# EAGLE design Motion_2 (EAGLE 9.5.2)
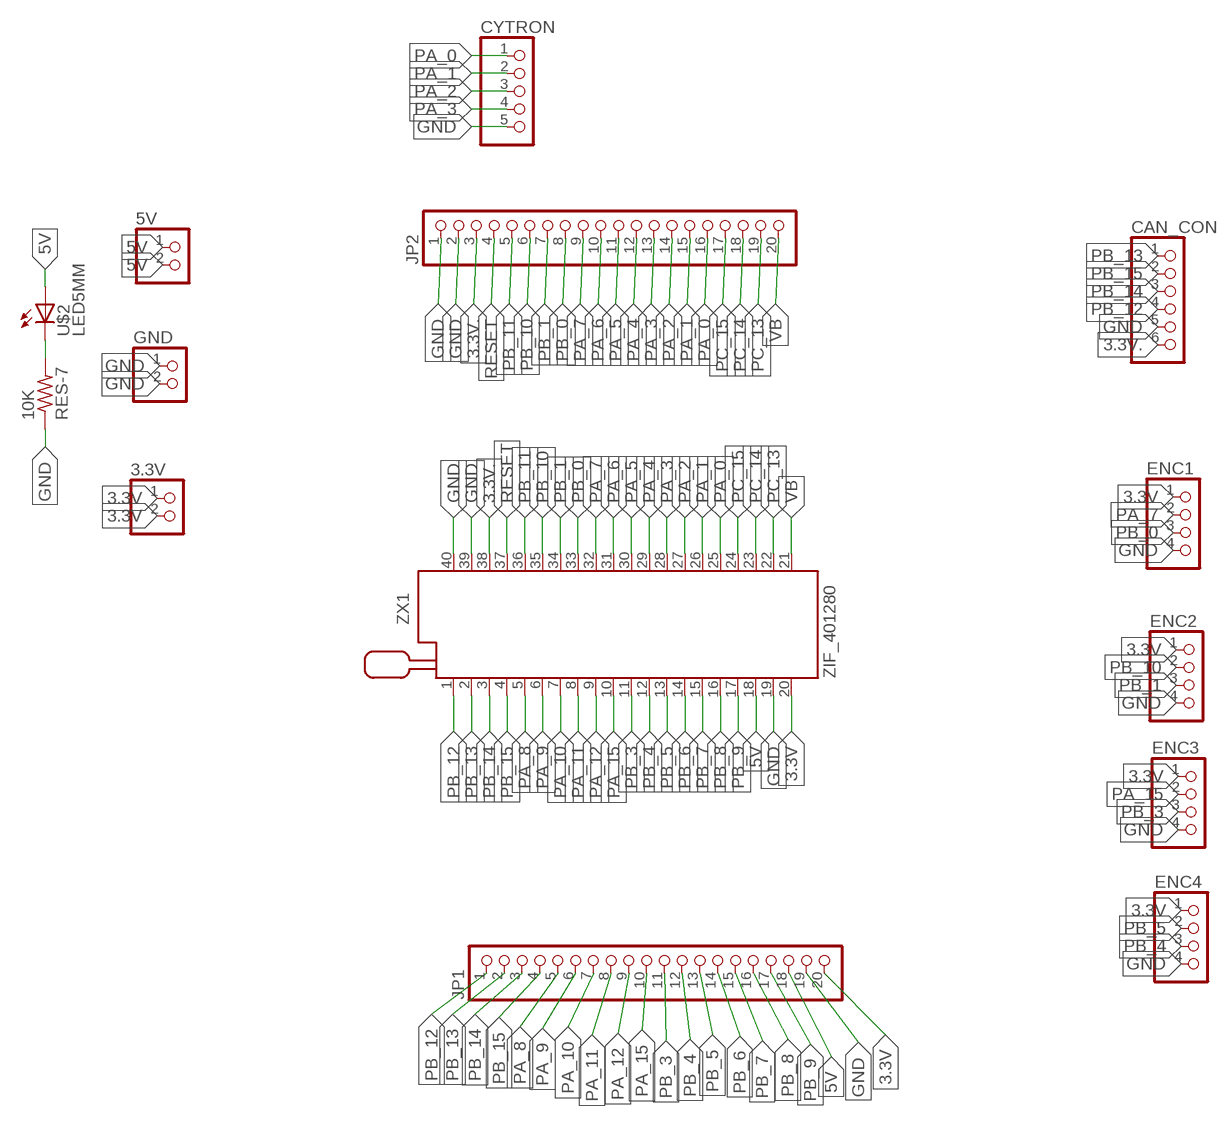
[diagram p0: schematic, sheet 1]

## Parts
3.3V  PINHD-2_DATA  [1X02_DATA]
5V  PINHD-2_DATA  [1X02_DATA]
10K  RES-7  [0204/7]
CAN_CON  PINHD-6_DATA  [1X06_DATA]
CYTRON  PINHD-5_DATA  [1X05_DATA]
ENC1  PINHD-4_DATA  [1X04_DATA]
ENC2  PINHD-4_DATA  [1X04_DATA]
ENC3  PINHD-4_DATA  [1X04_DATA]
ENC4  PINHD-4_DATA  [1X04_DATA]
GND  PINHD-2_DATA  [1X02_DATA]
JP1  PINHD-1X20  [1X20]
JP2  PINHD-1X20  [1X20]
U$2  LED5MM  [LED5MM]
ZX1  ZIF_401280  [240-1280-00-0602J]

## Nets
3.3V: 3.3V.1 3.3V.2 ENC1.1 ENC2.1 ENC3.1 ENC4.1 JP1.20 ZX1.20
3.3V.: CAN_CON.6 JP2.3 ZX1.38
5V: 5V.1 5V.2 JP1.18 U$2.A ZX1.18
GND: 10K.1 CAN_CON.5 CYTRON.5 ENC1.4 ENC2.4 ENC3.4 ENC4.4 GND.1 GND.2 JP1.19 JP2.1 JP2.2 ZX1.19 ZX1.39 ZX1.40
N$1: 10K.2 U$2.K(C)
PA_0: CYTRON.1 JP2.16 ZX1.25
PA_1: CYTRON.2 JP2.15 ZX1.26
PA_2: CYTRON.3 JP2.14 ZX1.27
PA_3: CYTRON.4 JP2.13 ZX1.28
PA_4: JP2.12 ZX1.29
PA_5: JP2.11 ZX1.30
PA_6: JP2.10 ZX1.31
PA_7: ENC1.2 JP2.9 ZX1.32
PA_8: JP1.5 ZX1.5
PA_9: JP1.6 ZX1.6
PA_10: JP1.7 ZX1.7
PA_11: JP1.8 ZX1.8
PA_12: JP1.9 ZX1.9
PA_15: ENC3.2 JP1.10 ZX1.10
PB_0: ENC1.3 JP2.8 ZX1.33
PB_1: ENC2.3 JP2.7 ZX1.34
PB_3: ENC3.3 JP1.11 ZX1.11
PB_4: ENC4.3 JP1.12 ZX1.12
PB_5: ENC4.2 JP1.13 ZX1.13
PB_6: JP1.14 ZX1.14
PB_7: JP1.15 ZX1.15
PB_8: JP1.16 ZX1.16
PB_9: JP1.17 ZX1.17
PB_10: ENC2.2 JP2.6 ZX1.35
PB_11: JP2.5 ZX1.36
PB_12: CAN_CON.4 JP1.1 ZX1.1
PB_13: CAN_CON.1 JP1.2 ZX1.2
PB_14: CAN_CON.3 JP1.3 ZX1.3
PB_15: CAN_CON.2 JP1.4 ZX1.4
PC_13: JP2.19 ZX1.22
PC_14: JP2.18 ZX1.23
PC_15: JP2.17 ZX1.24
RESET: JP2.4 ZX1.37
VB: JP2.20 ZX1.21

## Library data of the parts
3.3V 5V GND = MIA_LIBRARY-2-2-2:PINHD-2_DATA: PIN HEADER
10K = MIA_LIBRARY-2-2-2:RES-7
CAN_CON = MIA_LIBRARY-2-2-2:PINHD-6_DATA: PIN HEADER
CYTRON = MIA_LIBRARY-2-2-2:PINHD-5_DATA: PIN HEADER
ENC1-ENC4 = MIA_LIBRARY-2-2-2:PINHD-4_DATA: PIN HEADER
JP1 JP2 = MIA_LIBRARY-2-2-2:PINHD-1X20: PIN HEADER
U$2 = MIA_LIBRARY-2-2-2:LED5MM
ZX1 = MIA_LIBRARY-2-2-2:ZIF_40: Zero Insertion Force Socked Source: http://www.3M.com/ehpd

## Board
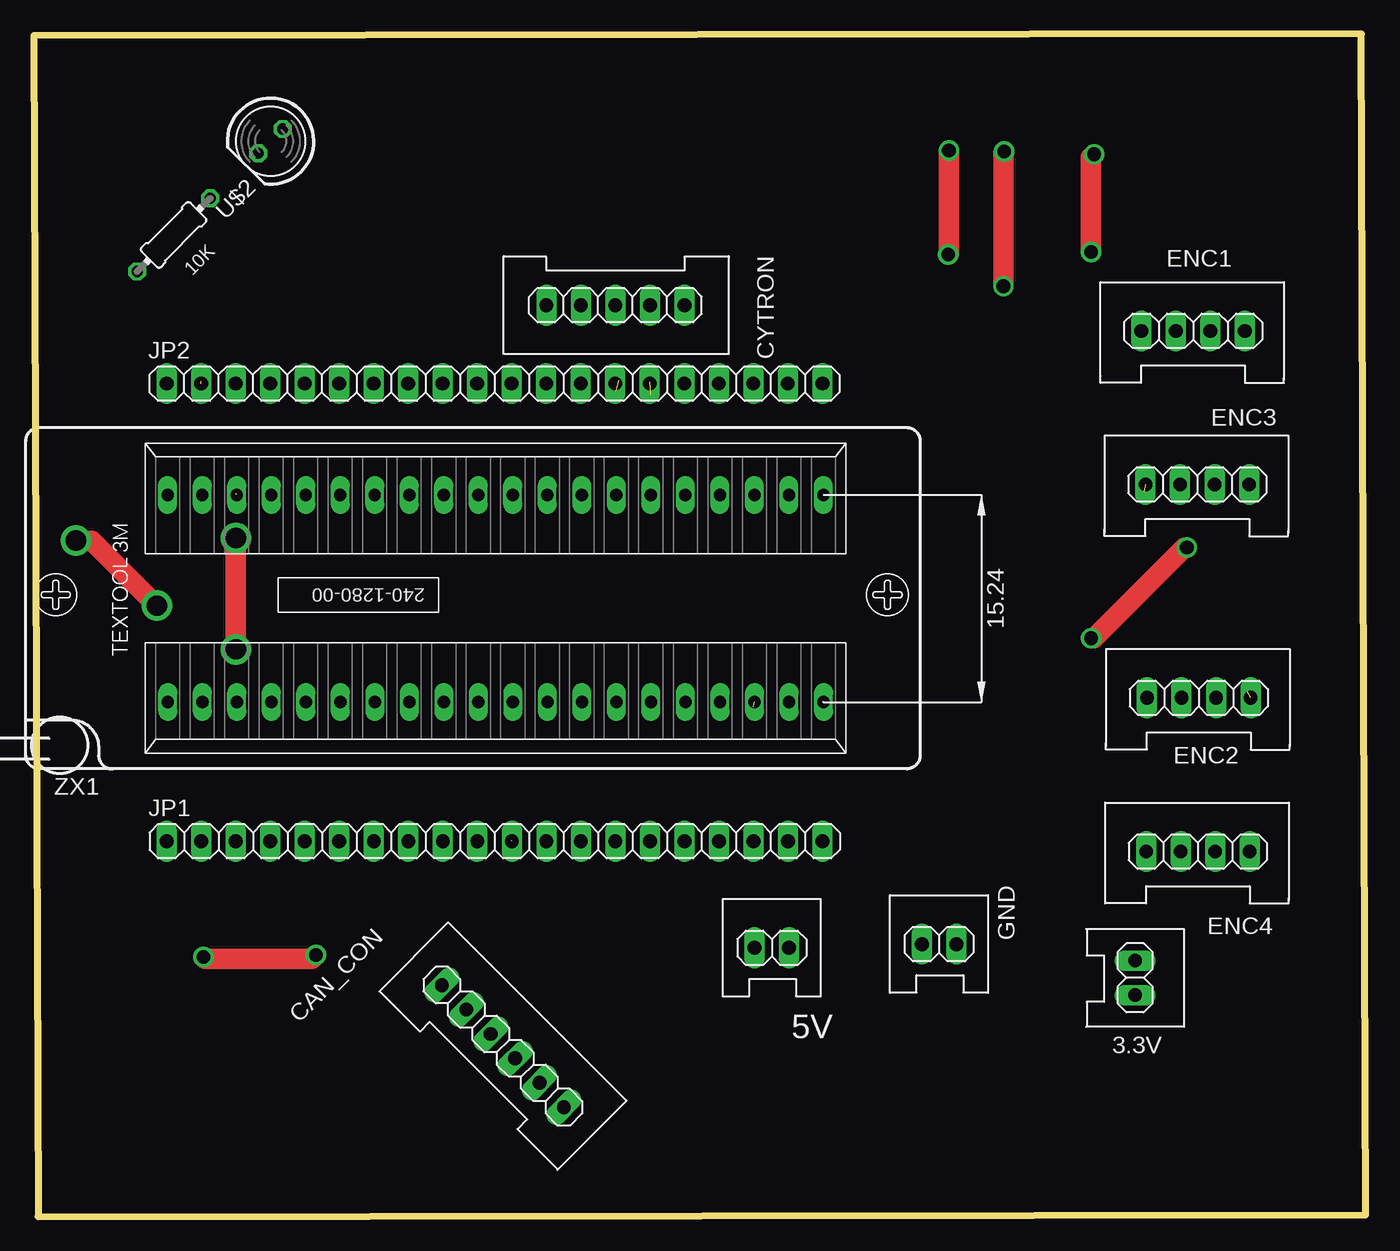
[diagram p1: board, top side]
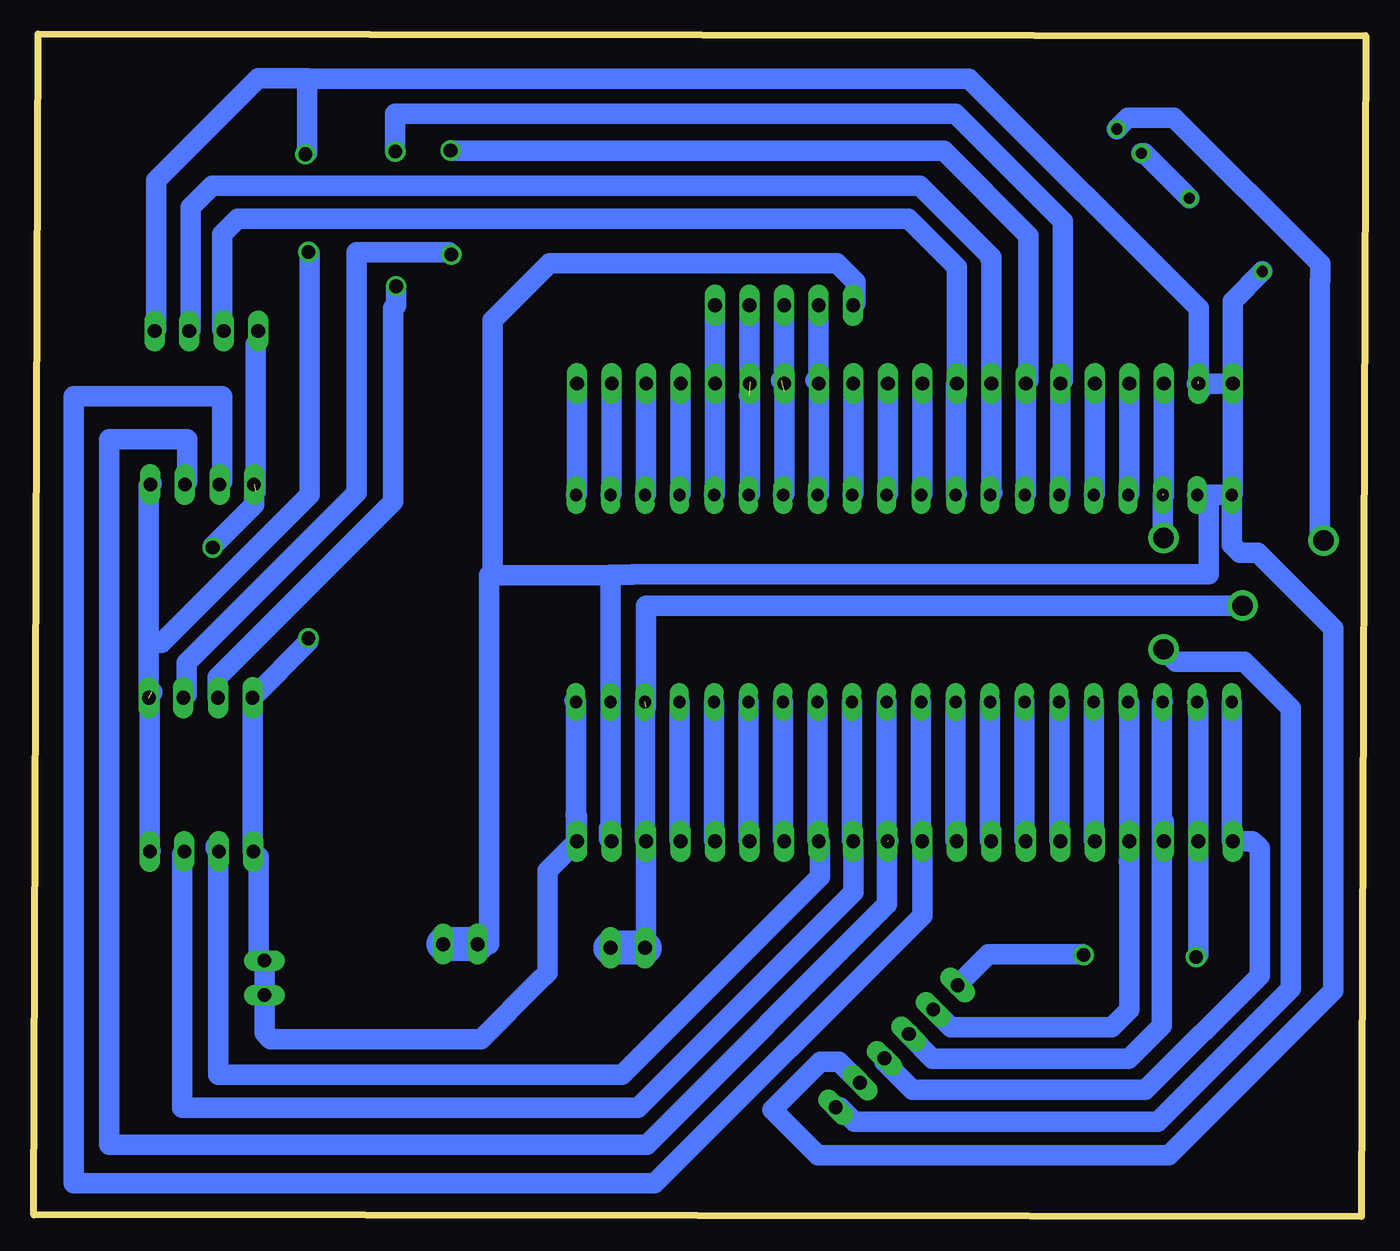
[diagram p2: board, bottom side, seen from below]

Size 98 x 87.01 mm. Coordinates in mm from the lower left corner, seen from the top.
Outline: 0.31,0 98,0.13 97.69,87.01 0,86.88 0.31,0
Copper layers (1*16): Top 0.035mm / dielectric 1.5mm / Bottom 0.035mm
Design rules "default *": minimum track width 6mil, minimum drill 0.35mm, track to track 0.8mm, track to pad 0.8mm, pad to pad 0.8mm, via to via 0.8mm, smd to smd 6mil, copper to edge 40mil, drill to drill 6mil, minimum pad ring 10mil, minimum via ring 8mil, stop-mask expansion 4mil, vias tented up to drill 0mil, thermal gap 10mil

### Footprints (pad centres in the part's own frame; a part is rotated, then mirrored left to right if it is on the bottom)
1X02_DATA = drill 1.016 long: 1 -1.27,0; 2 1.27,0
0204/7 = drill 0.813 octagon: 1 -3.81,0; 2 3.81,0
1X06_DATA = drill 1.016 long: 1 -6.35,0; 2 -3.81,0; 3 -1.27,0; 4 1.27,0; 5 3.81,0; 6 6.35,0
1X05_DATA = drill 1.016 long: 1 -5.08,0; 2 -2.54,0; 3 0,0; 4 2.54,0; 5 5.08,0
1X04_DATA = drill 1.016 long: 1 -3.81,0; 2 -1.27,0; 3 1.27,0; 4 3.81,0
1X20 = drill 1.016 long: 1 -24.13,0; 2 -21.59,0; 3 -19.05,0; 4 -16.51,0; 5 -13.97,0; 6 -11.43,0; 7 -8.89,0; 8 -6.35,0; 9 -3.81,0; 10 -1.27,0; 11 1.27,0; 12 3.81,0; 13 6.35,0; 14 8.89,0; 15 11.43,0; 16 13.97,0; 17 16.51,0; 18 19.05,0; 19 21.59,0; 20 24.13,0
LED5MM = drill 0.813 octagon: A -1.27,0; K 1.27,0
240-1280-00-0602J = drill 0.9 long: 1 -24.12,-8.88; 2 -21.58,-8.88; 3 -19.04,-8.88; 4 -16.5,-8.88; 5 -13.96,-8.88; 6 -11.42,-8.88; 7 -8.88,-8.88; 8 -6.34,-8.88; 9 -3.8,-8.88; 10 -1.26,-8.88; 11 1.28,-8.88; 12 3.82,-8.88; 13 6.36,-8.88; 14 8.9,-8.88; 15 11.44,-8.88; 16 13.98,-8.88; 17 16.52,-8.88; 18 19.06,-8.88; 19 21.6,-8.88; 20 24.14,-8.88; 21 24.13,6.35; 22 21.59,6.35; 23 19.05,6.35; 24 16.51,6.35; 25 13.97,6.35; 26 11.43,6.35; 27 8.89,6.35; 28 6.35,6.35; 29 3.81,6.35; 30 1.27,6.35; 31 -1.27,6.35; 32 -3.81,6.35; 33 -6.35,6.35; 34 -8.89,6.35; 35 -11.43,6.35; 36 -13.97,6.35; 37 -16.51,6.35; 38 -19.05,6.35; 39 -21.59,6.35; 40 -24.13,6.35

### Placement (x,y rotation side)
3.3V  81.04,17.57 270 top
5V  54.3,19.78 0 top
10K  10.28,72.23 45 top
CAN_CON  34.51,12.54 315 top
CYTRON  42.79,67.06 180 top
ENC1  85.31,65.16 0 top
ENC2  85.73,38.17 0 top
ENC3  85.62,53.87 0 top
ENC4  85.66,26.86 0 top
GND  66.61,20.05 0 top
JP1  33.9,27.62 0 top
JP2  33.89,61.29 0 top
U$2  17.41,79.12 225 top
ZX1  33.97,46.75 0 top

### Tracks (layer width: path | path; a pad name or v marks a point on that pad's centre or on a via)
3.3V  (via drill 1)  (1 unrouted)
  Top 1.5: v77.81,42.55 77.99,42.55 84.66,49.22 v84.85,49.22
  Bottom 1.5: JP1.20 58.03,27.27 | ENC1.1 81.5,64.4 81.7,64.2 81.7,53.34 | 81.8,38.29 ENC2.1 | ENC2.1 81.92,26.93 ENC4.1 | JP1.20 58.03,29.44 58.15,29.56 | 81.75,26.76 ENC4.1 | ENC4.1 81.45,26.46 81.45,19.26 80.88,18.69 80.89,18.69 3.3V.1 3.3V.2 81.04,13.52 80.58,13.06 65.09,13.06 60.92,17.23 60.21,17.94 60.21,25.44 JP1.20 | ENC2.1 77.81,42.28 v77.81,42.55 | v84.85,49.22 84.85,49.34 81.81,52.38 ENC3.1 | JP1.20 58.11,27.7 ZX1.20 58.2,37.96
3.3V.  (via drill 1.5)  (1 unrouted)
  Top 1.5: v14.86,49.92 v14.86,41.74
  Bottom 1.5: 14.84,53.02 ZX1.38 14.92,49.98 v14.86,49.92 | JP2.3 14.84,53.18 | CAN_CON.6 38.68,8.05 37.62,7 15.27,7 5.5,16.77 5.5,37.41 8.92,40.83 13.95,40.83 v14.86,41.74
5V  (via drill 1.5)  (1 unrouted)
  Top 1.5: v3.1,49.74 4.27,49.74 v9.05,44.96 v9.05,44.95
  Bottom 1.5: JP1.18 53.04,27.71 53.04,29.1 | v9.05,44.95 52.97,44.95 52.97,37.51 | v3.1,49.74 3.36,49.48 3.37,49.48 3.37,68.84 3.34,68.87 3.34,70.11 14.09,80.86 17.48,80.86 18.26,80.09 18.26,80.07 U$2.A | ZX1.18 53.03,27.7 JP1.18 | JP1.18 52.95,19.86 5V.1
  Bottom 2.5: 5V.1 5V.2
GND  (via drill 1)  (2 unrouted)
  Top 1.5: v77.8,70.98 77.8,77.95 v78.01,78.16
  Bottom 1: GND.1 65.34,20 65.22,19.88
  Bottom 1.5: 12.09,61.25 12.09,60.89 12.26,61.06 12.26,66.81 29.18,83.73 77.9,83.73 | 12.09,61.25 12.09,61.43 12.33,61.19 12.43,61.29 JP2.1 | 89.34,53.96 ENC3.4 89.54,53.76 89.54,42.22 | 89.42,26.91 ENC4.4 89.47,38.39 89.31,38.55 89.31,38.6 | 55.69,28.58 55.69,27.82 JP1.19 55.57,27.7 ZX1.19 55.57,47.2 | ENC2.4 89.54,42.22 | 12.09,61.25 12.3,61.46 | ENC1.4 89.01,65.27 89.01,76.23 81.5,83.75 77.9,83.75 77.9,83.73 | GND.1 65.19,20.2 65.16,20.2 | v77.8,70.98 77.7,70.88 77.7,53.1 88.58,42.22 89.54,42.22 | v78.01,78.16 77.9,78.27 77.9,83.73 | 68.17,19.76 GND.2 64.49,20.05 64.49,47.2 64.26,47.2 | CAN_CON.5 37.22,9.85 38.75,11.38 40.13,11.38 43.64,7.87 40.29,4.52 14.49,4.52 2.39,16.62 2.39,43.28 7.93,48.83 9.25,48.83 9.84,49.42 ZX1.40 | JP2.1 9.76,67.36 10K.1 | CYTRON.5 37.56,67.21 37.56,68.78 38.91,70.13 60.07,70.13 64.26,65.94 64.26,47.2 | JP2.1 9.76,53.18 ZX1.40 | ZX1.40 11.54,53.1 11.54,47.25 53.92,47.25 53.96,47.21 55.57,47.21 55.57,47.2 | 11.71,53.1 ZX1.39 | 55.57,47.2 64.26,47.2
  Bottom 2.5: GND.1 GND.2
N$1
  Bottom 1.5: 10K.2 16.27,78.22 U$2.K
PA_0
  Bottom 1.5: CYTRON.1 47.88,60.77 47.86,60.75 JP2.16 47.86,53.18 ZX1.25
PA_1  (1 unrouted)
  Bottom 1.5: 45.34,61.43 45.32,61.41 JP2.15 45.32,53.18 ZX1.26 | CYTRON.2 45.33,60.48 45.38,60.43
PA_2  (1 unrouted)
  Bottom 1.5: 42.79,60.72 CYTRON.3 | 43.01,61.52 JP2.14 42.78,53.18 ZX1.27
PA_3
  Bottom 1.5: 40.24,61.74 JP2.13 | JP2.13 40.47,61.52 | JP2.13 CYTRON.4 | JP2.13 40.24,53.18 ZX1.28
PA_4
  Bottom 1.5: JP2.12 37.7,53.18 ZX1.29
PA_5
  Bottom 1.5: JP2.11 35.16,53.18 ZX1.30
PA_6
  Bottom 1.5: JP2.10 32.62,53.18 ZX1.31
PA_7
  Bottom 1.5: 84.02,65.18 ENC1.2 84.16,65.28 84.16,72.26 83,73.42 33.66,73.42 30.08,69.84 JP2.9 30.16,61.21 ZX1.32 30.08,53.18
PA_8
  Bottom 1.5: ZX1.5 20.01,27.7 JP1.5
PA_9
  Bottom 1.5: ZX1.6 22.55,27.7 JP1.6
PA_10
  Bottom 1.5: ZX1.7 25.09,27.7 JP1.7
PA_11
  Bottom 1.5: ZX1.8 27.63,27.7 JP1.8
PA_12
  Bottom 1.5: ZX1.9 30.17,27.7 JP1.9
PA_15
  Bottom 1.5: ENC3.2 84.14,54.08 84.14,60.37 95.07,60.37 95.07,2.46 52.32,2.46 32.63,22.14 JP1.10 32.71,27.7 ZX1.10
PB_0
  Bottom 1.5: 86.56,65.18 ENC1.3 86.47,65.27 86.47,74.25 84.88,75.84 32.81,75.84 27.54,70.57 27.54,70.46 | 27.63,70.55 27.54,70.46 | 27.45,53.27 ZX1.33 27.56,53.1 27.54,53.12 JP2.8 27.54,70.46
PB_1  (via drill 1)
  Top 1.5: v67.34,78.43 67.34,70.84 v67.29,70.79
  Bottom 1.5: ENC2.3 86.77,38.4 86.77,40.75 74.25,53.27 74.25,70.94 67.44,70.94 v67.29,70.79 | v67.34,78.43 67.32,78.41 31.04,78.41 24.81,72.17 24.81,61.48 JP2.7 25,53.18 ZX1.34
PB_3  (1 unrouted)
  Bottom 1.5: ENC3.3 86.71,54.05 86.71,57.19 92.45,57.19 92.45,5.31 52.9,5.31 35.21,23 35.21,27.58 JP1.11 | ZX1.11 35.25,27.79 35.12,27.66
PB_4
  Bottom 1.5: ENC4.3 87.11,26.68 87.11,8.02 53.55,8.02 37.69,23.88 37.69,27.6 JP1.12 37.79,27.7 ZX1.12
PB_5
  Bottom 1.5: 84.62,27.26 84.62,27.09 ENC4.2 84.39,27.2 84.45,27.26 84.45,10.44 54.72,10.44 40.16,25 40.16,27.53 JP1.13 40.33,27.7 ZX1.13
PB_6
  Bottom 1.5: ZX1.14 42.87,27.7 JP1.14
PB_7
  Bottom 1.5: ZX1.15 45.41,27.7 JP1.15
PB_8
  Bottom 1.5: ZX1.16 47.95,27.7 JP1.16
PB_9
  Bottom 1.5: ZX1.17 50.49,27.7 JP1.17
PB_10  (via drill 1)
  Top 1.5: v71.41,78.35 71.34,78.28 71.34,69.03 71.35,69.02 v71.35,68.45
  Bottom 1.5: ENC2.2 84.47,39.67 71.55,52.59 71.55,66.82 71.35,67.02 v71.35,68.45 | v71.41,78.35 71.41,81.15 30.2,81.15 22.27,73.22 22.27,61.48 JP2.6 22.46,53.18 ZX1.35
PB_11
  Bottom 1.5: JP2.5 19.92,53.18 ZX1.36
PB_12
  Bottom 1.5: CAN_CON.4 35.41,11.4 33.34,9.33 16.19,9.33 7.8,17.72 7.8,27.1 8.32,27.62 JP1.1 9.85,27.7 ZX1.1
PB_13  (via drill 1)
  Top 1.5: v20.76,19.26 20.47,18.97 12.6,18.97 v12.47,19.1
  Bottom 1.5: v12.47,19.1 12.31,19.26 JP1.2 12.31,37.79 ZX1.2 | v20.76,19.26 20.81,19.31 27.74,19.31 CAN_CON.1
PB_14
  Bottom 1.5: 15,29.2 14.85,29.05 JP1.3 | 15,29.2 15,14.04 17.41,11.63 31.87,11.63 33.61,13.37 CAN_CON.3 | ZX1.3 15,37.8 15,29.2
PB_15
  Bottom 1.5: 17.42,26.12 17.39,26.15 JP1.4 | CAN_CON.2 30.51,13.93 18.68,13.93 17.39,15.22 JP1.4 | ZX1.4 17.39,37.79 JP1.4
PC_13
  Bottom 1.5: JP2.19 55.48,53.18 ZX1.22
PC_14
  Bottom 1.5: JP2.18 52.94,53.18 ZX1.23
PC_15
  Bottom 1.5: JP2.17 50.4,53.18 ZX1.24
RESET
  Bottom 1.5: JP2.4 17.38,53.18 ZX1.37
VB
  Bottom 1.5: JP2.20 58.02,53.18 ZX1.21

### Text on the board
tNames: 5V